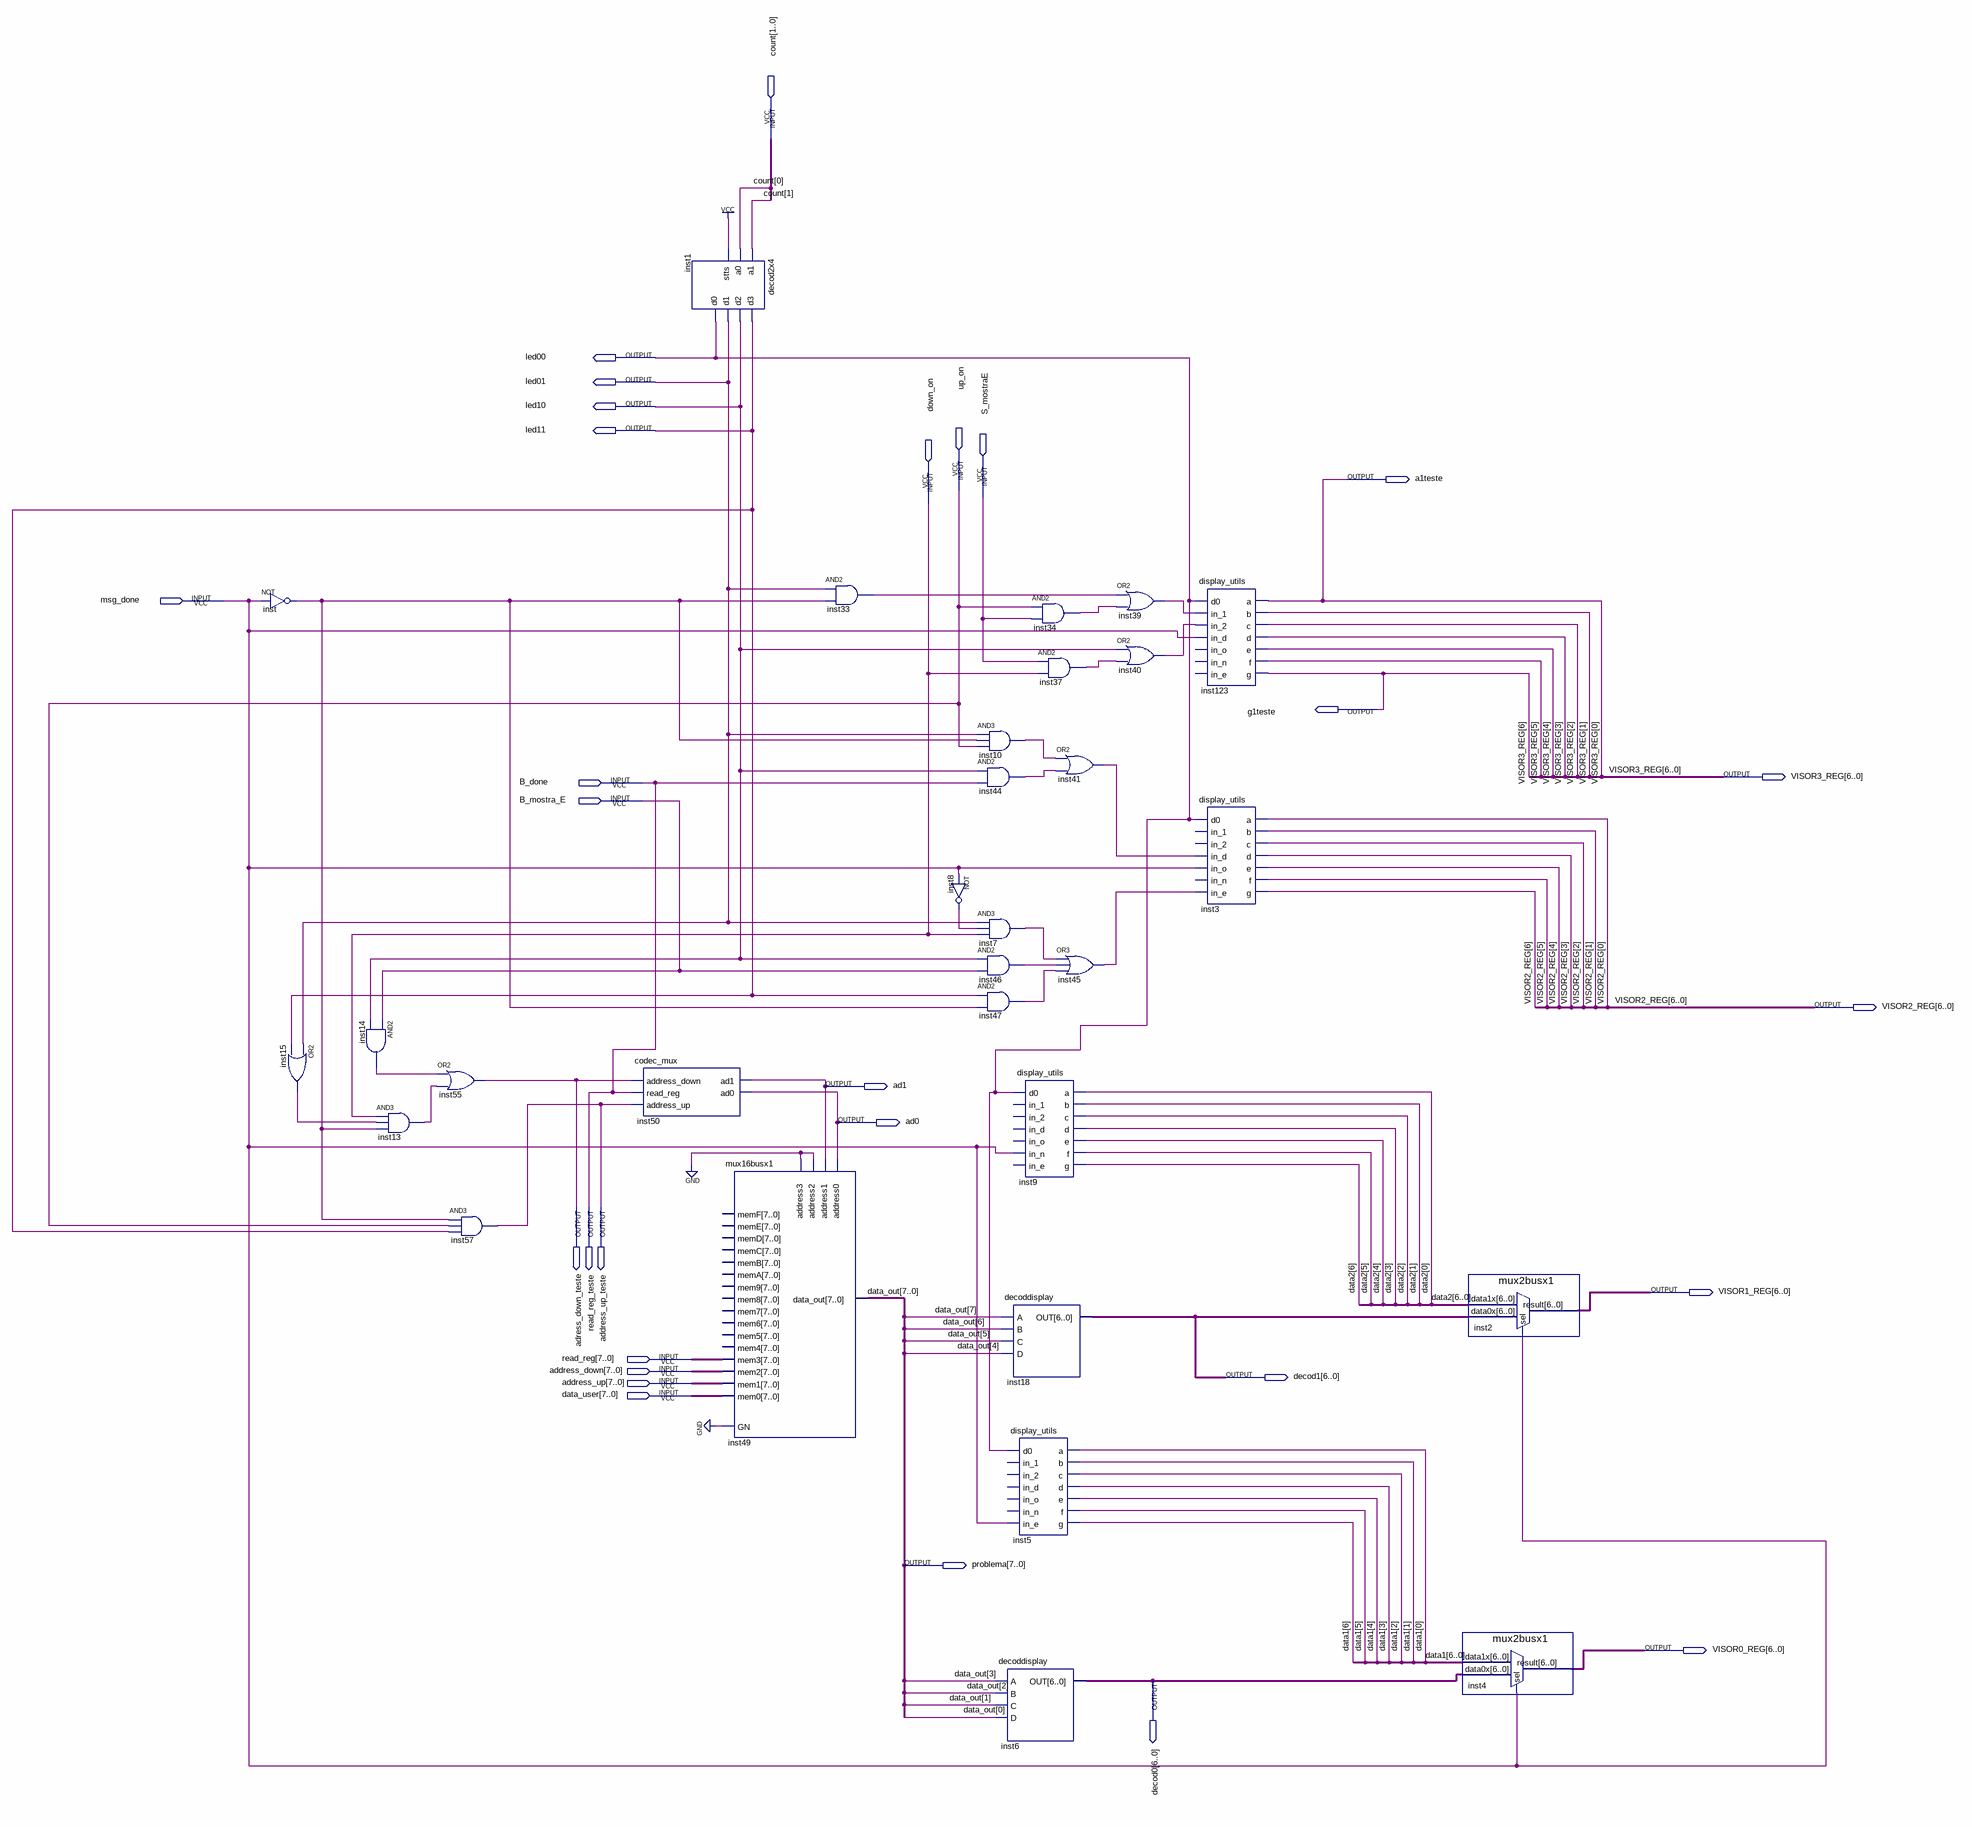
[diagram p0: schematic sheet]
// Quartus schematic controlevisor.bdf as structural Verilog: 30 symbols, 29 pins
module controlevisor (
  input  [1:0] count,
  input  up_on,
  input  S_mostraE,
  input  down_on,
  input  msg_done,
  input  B_done,
  input  B_mostra_E,
  input  [7:0] read_reg,
  input  [7:0] address_down,
  input  [7:0] address_up,
  input  [7:0] data_user,
  output led00,
  output led01,
  output led10,
  output led11,
  output a1teste,
  output g1teste,
  output [6:0] VISOR3_REG,
  output [6:0] VISOR2_REG,
  output ad1,
  output ad0,
  output adress_down_teste,
  output read_reg_teste,
  output address_up_teste,
  output [6:0] VISOR1_REG,
  output [6:0] decod1,
  output [7:0] problema,
  output [6:0] VISOR0_REG,
  output [6:0] decod0
);

  wire inst7_out, inst8_out, inst10_out, inst13_out, inst14_out, inst15_out, inst33_out, inst34_out,
       inst37_out, inst39_out, inst40_out, inst41_out, inst44_out, inst45_out, inst46_out, inst47_out,
       inst_out;
  wire [6:0] data1, data2;

  not inst (inst_out, msg_done);
  or inst15 (inst15_out, led01, led11);
  and inst14 (inst14_out, B_mostra_E, led10);
  and inst13 (inst13_out, down_on, inst15_out, inst_out);
  or inst55 (adress_down_teste, inst14_out, inst13_out);
  and inst57 (address_up_teste, inst_out, up_on, led11);
  codec_mux inst50 (
    .address_down(adress_down_teste), .read_reg(B_done), .address_up(address_up_teste), .ad1(ad1), .ad0(ad0));
  decod2x4 inst1 (.a1(count[1]), .a0(count[0]), .stts(1'b1), .d3(led11), .d2(led10), .d1(led01), .d0(led00));
  mux16busx1 inst49 (
    .mem3(read_reg), .mem2(address_down), .mem1(address_up), .mem0(data_user), .GN(1'b0), .address0(ad0),
    .address1(ad1), .address2(1'b0), .address3(1'b0), .data_out(problema));  // open: memF, memE, memD, memC, memB, memA, mem9, mem8, mem7, mem6, mem5, mem4
  and inst33 (inst33_out, led01, inst_out);
  not inst8 (inst8_out, msg_done);
  and inst10 (inst10_out, led01, inst_out, up_on);
  and inst44 (inst44_out, led10, B_done);
  and inst7 (inst7_out, led01, inst8_out, down_on);
  and inst46 (inst46_out, led10, B_mostra_E);
  and inst47 (inst47_out, led11, inst_out);
  decoddisplay inst18 (.A(problema[7]), .B(problema[6]), .C(problema[5]), .D(problema[4]), .OUT(decod1));
  decoddisplay inst6 (.A(problema[3]), .B(problema[2]), .C(problema[1]), .D(problema[0]), .OUT(decod0));
  and inst34 (inst34_out, up_on, S_mostraE);
  and inst37 (inst37_out, S_mostraE, down_on);
  display_utils inst9 (
    .d0(led00), .in_n(msg_done), .a(data2[0]), .b(data2[1]), .c(data2[2]), .d(data2[3]), .e(data2[4]),
    .f(data2[5]), .g(data2[6]));  // open: in_1, in_2, in_d, in_o, in_e
  display_utils inst5 (
    .d0(led00), .in_e(msg_done), .a(data1[0]), .b(data1[1]), .c(data1[2]), .d(data1[3]), .e(data1[4]),
    .f(data1[5]), .g(data1[6]));  // open: in_1, in_2, in_d, in_o, in_n
  or inst41 (inst41_out, inst10_out, inst44_out);
  or inst45 (inst45_out, inst7_out, inst46_out, inst47_out);
  or inst39 (inst39_out, inst33_out, inst34_out);
  or inst40 (inst40_out, led10, inst37_out);
  display_utils inst123 (
    .d0(led00), .in_1(inst39_out), .in_2(inst40_out), .in_d(msg_done), .a(a1teste), .b(VISOR3_REG[1]),
    .c(VISOR3_REG[2]), .d(VISOR3_REG[3]), .e(VISOR3_REG[4]), .f(VISOR3_REG[5]), .g(g1teste));  // open: in_o, in_n, in_e
  display_utils inst3 (
    .d0(led00), .in_d(inst41_out), .in_o(msg_done), .in_e(inst45_out), .a(VISOR2_REG[0]), .b(VISOR2_REG[1]),
    .c(VISOR2_REG[2]), .d(VISOR2_REG[3]), .e(VISOR2_REG[4]), .f(VISOR2_REG[5]), .g(VISOR2_REG[6]));  // open: in_1, in_2, in_n
  mux2busx1 inst2 (.data1x(data2), .data0x(decod1), .sel(msg_done), .result(VISOR1_REG));
  mux2busx1 inst4 (.data1x(data1), .data0x(decod0), .sel(msg_done), .result(VISOR0_REG));

  assign read_reg_teste = B_done;
  assign {VISOR3_REG[6], VISOR3_REG[0]} = {g1teste, a1teste};

  // Other names for the same wires on the sheet: data_out[7:0] = problema
endmodule
